# Altium schematic sheet PROC051C_DUT_Reference.SchDoc: DUT
size 431 x 279 mm; Date: Not shown in title block; ApprovedBy: Not shown in title block; CheckedBy: Not shown in title block; Author: Not shown in title block; CompanyName: Not shown in title block; Engineer: Not shown in title block; Organization: Not shown in title block; Address1: Not shown in title block; Address2: Not shown in title block; Address3: Not shown in title block; Address4: Not shown in title block; DocumentNumber: 2; Revision: Use project parameter SCH_Rev; SheetNumber: 2; SheetTotal: 16; PageSetup: Record=PageOptions|CenterHorizontal=True|CenterVertical=True|PrintScale=1.00|XCorrection=1.00|YCorrection=1.00|PrintKind=0|BorderSize=5000000|LeftOffset=0|BottomOffset=0|Orientation=2|PaperLength=1000|PaperWidth=1000|Scale=100|PaperSource=15|PrintQuality=-3|MediaType=1|DitherType=10|PrintScaleMode=1|PaperKind=Letter|PaperIndex=1; CurrentTime: Not shown in title block; CurrentDate: Not shown in title block; Time: Not shown in title block; DocumentFullPathAndName: Not shown in title block; DocumentName: Not shown in title block; ModifiedDate: Not shown in title block; ImagePath: Not shown in title block
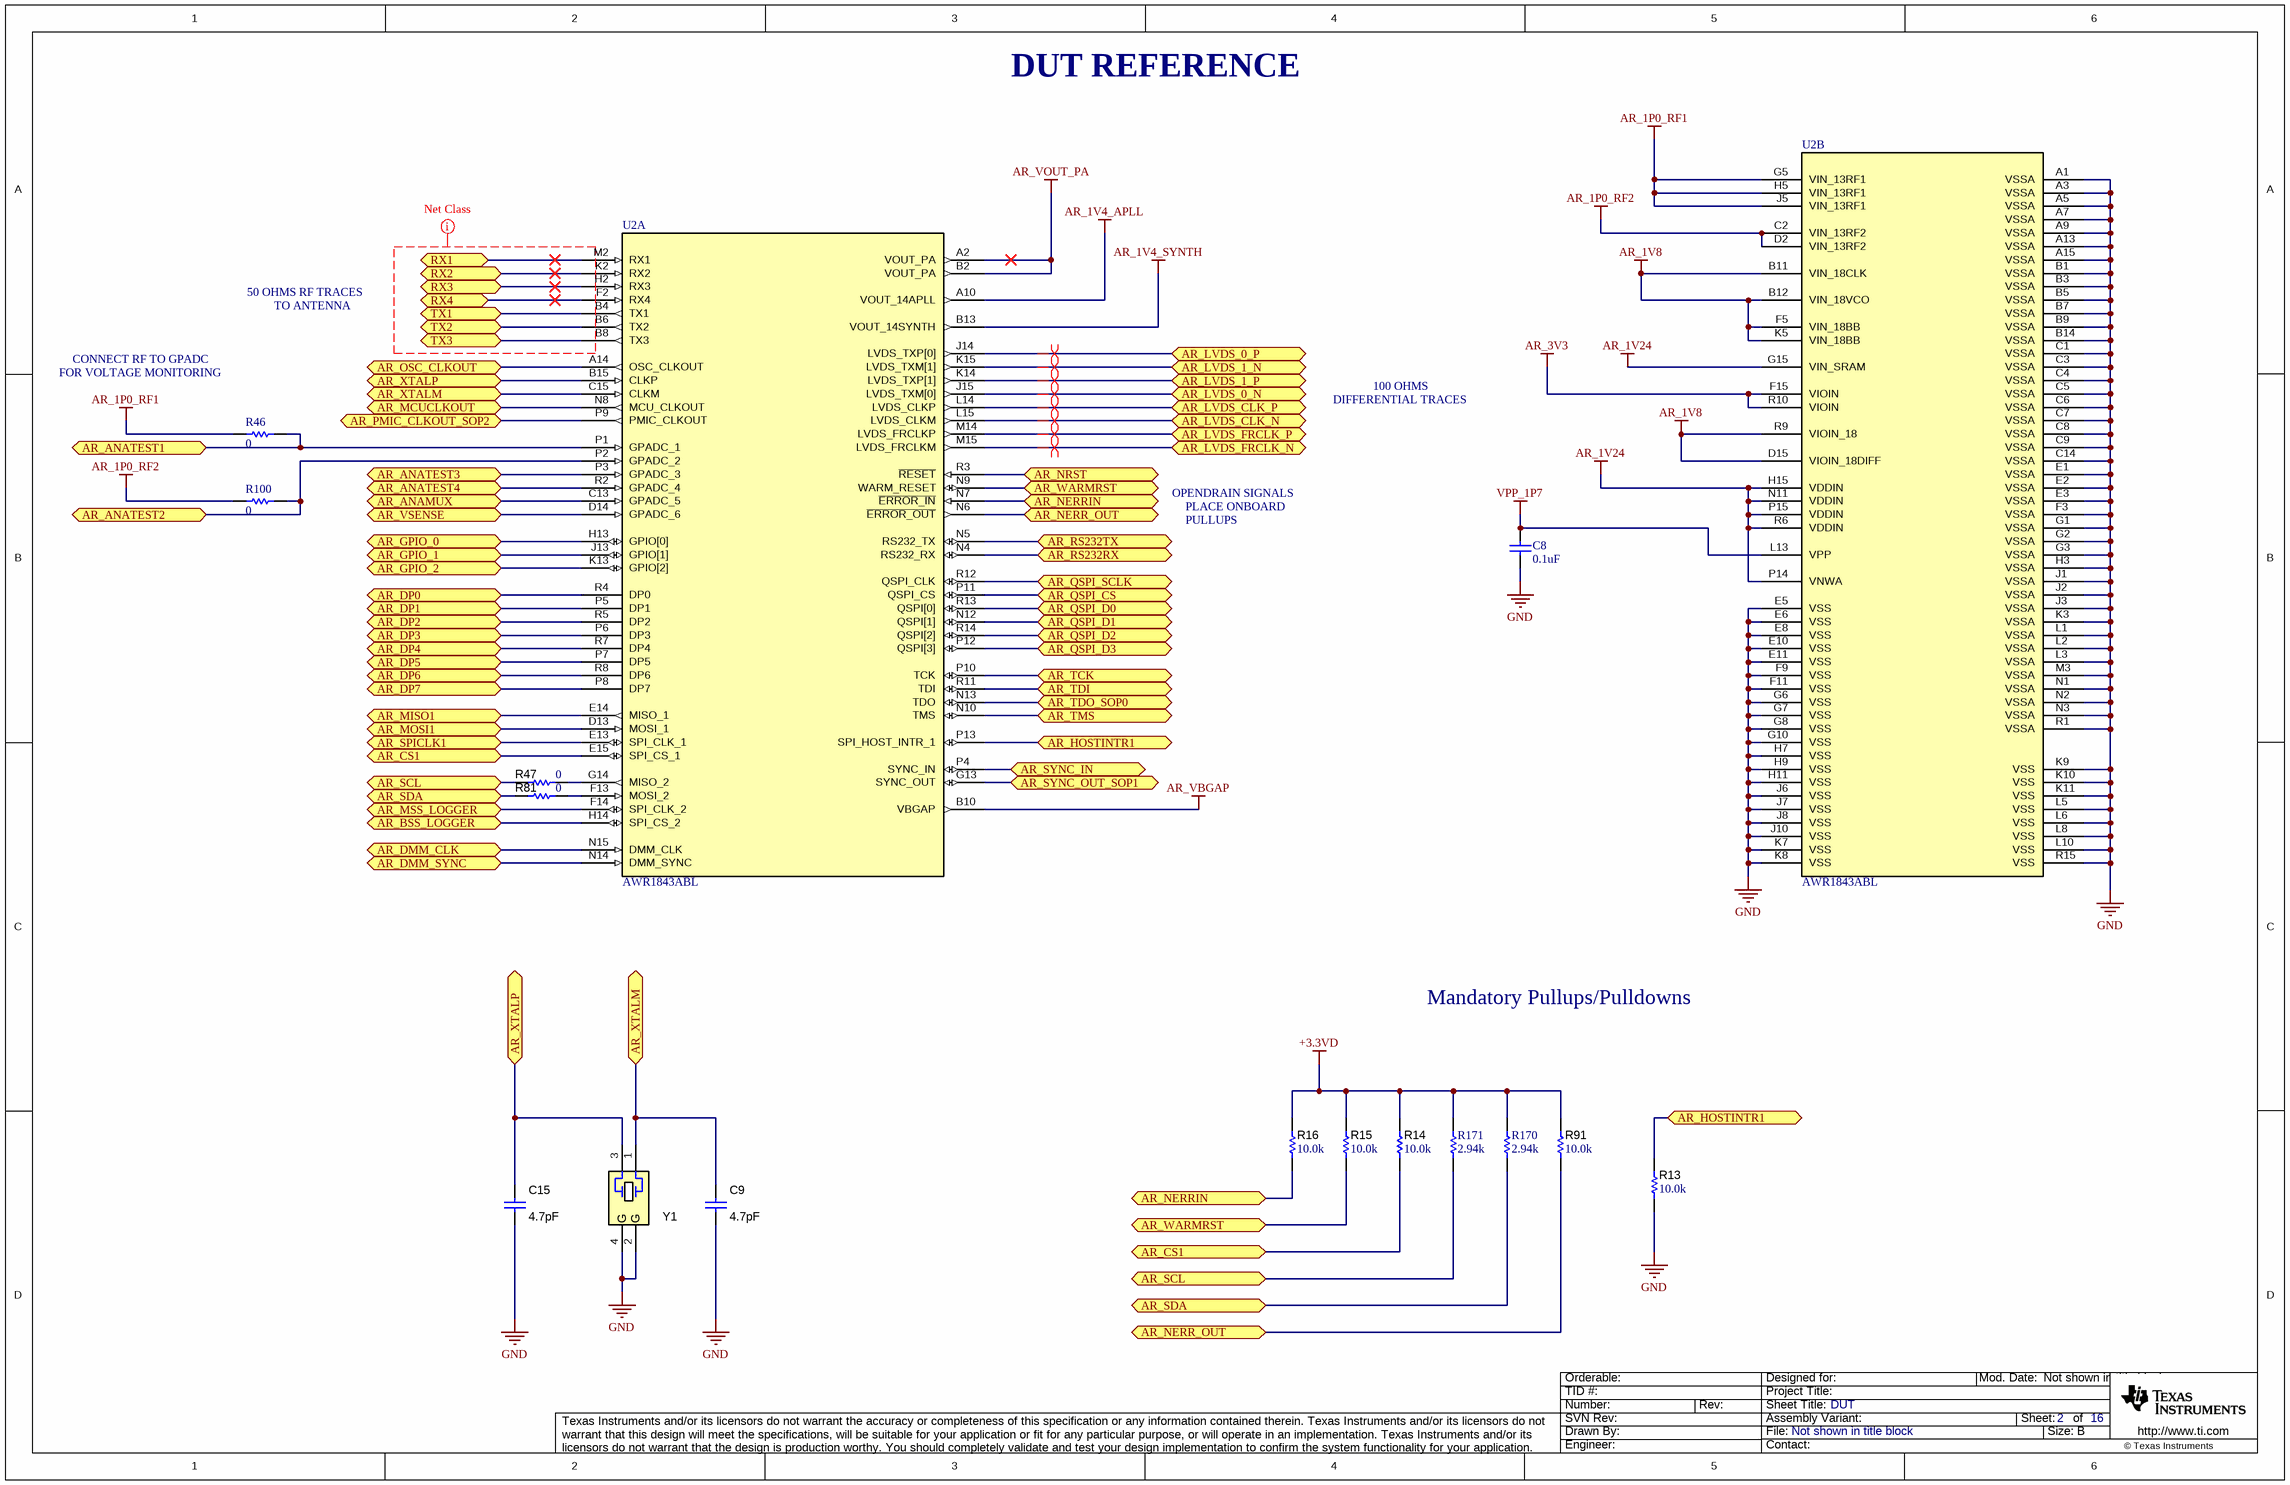
[diagram p0: PROC051C_DUT_Reference.SchDoc]

## Parts
C8  ValueDisplayed: 0.1uF  [0201]  (hidden comment: GRM033C71A104KE14D)
C9  ValueDisplayed: 4.7pF  [0402L]  (hidden comment: GJM1555C1H4R7BB01D)
C15  ValueDisplayed: 4.7pF  [0402L]  (hidden comment: GJM1555C1H4R7BB01D)
R13  ValueDisplayed: 10.0k  [0402L]  (hidden comment: CRCW040210K0FKED)
R14  ValueDisplayed: 10.0k  [0402L]  (hidden comment: CRCW040210K0FKED)
R15  ValueDisplayed: 10.0k  [0402L]  (hidden comment: CRCW040210K0FKED)
R16  ValueDisplayed: 10.0k  [0402L]  (hidden comment: CRCW040210K0FKED)
R46  ValueDisplayed: 0  [0402]  (hidden comment: CRCW04020000Z0ED)
R47  value 0  [0402L]  (hidden comment: Resistor)
R81  value 0  [0402L]  (hidden comment: Resistor)
R91  ValueDisplayed: 10.0k  [0402L]  (hidden comment: CRCW040210K0FKED)
R100  ValueDisplayed: 0  [0402]  (hidden comment: CRCW04020000Z0ED)
R170  ValueDisplayed: 2.94k  [0402]  (hidden comment: CRCW04022K94FKED)
R171  ValueDisplayed: 2.94k  [0402]  (hidden comment: CRCW04022K94FKED)
U2  AWR1843ABL  [ABL0161B]  (parts A,B of 2)
Y1  CX3225SA40000D0PTWCC  [Kyocera_CX3225SA]  (value not drawn)

## Ports
AR_ANAMUX, AR_ANATEST1, AR_ANATEST2, AR_ANATEST3, AR_ANATEST4, AR_BSS_LOGGER, AR_CS1, AR_DMM_CLK, AR_DMM_SYNC, AR_DP0, AR_DP1, AR_DP2, AR_DP3, AR_DP4, AR_DP5, AR_DP6, AR_DP7, AR_GPIO_0, AR_GPIO_1, AR_GPIO_2, AR_HOSTINTR1, AR_LVDS_0_N, AR_LVDS_0_P, AR_LVDS_1_N, AR_LVDS_1_P, AR_LVDS_CLK_N, AR_LVDS_CLK_P, AR_LVDS_FRCLK_N, AR_LVDS_FRCLK_P, AR_MCUCLKOUT, AR_MISO1, AR_MOSI1, AR_MSS_LOGGER, AR_NERR_OUT, AR_NERRIN, AR_NRST, AR_OSC_CLKOUT, AR_PMIC_CLKOUT_SOP2, AR_QSPI_CS, AR_QSPI_D0, AR_QSPI_D1, AR_QSPI_D2, AR_QSPI_D3, AR_QSPI_SCLK, AR_RS232RX, AR_RS232TX, AR_SCL, AR_SDA, AR_SPICLK1, AR_SYNC_IN, AR_SYNC_OUT_SOP1, AR_TCK, AR_TDI, AR_TDO_SOP0, AR_TMS, AR_VSENSE, AR_WARMRST, AR_XTALM, AR_XTALP, RX1, RX2, RX3, RX4, TX1, TX2, TX3

## Nets
+3.3VD: R14.2 R15.2 R16.2 R91.2 R170.2 R171.2
AR_1P0_RF1: R46.2 U2.G5(VIN_13RF1) U2.H5(VIN_13RF1) U2.J5(VIN_13RF1)
AR_1P0_RF2: R100.2 U2.C2(VIN_13RF2) U2.D2(VIN_13RF2)
AR_1V4_APLL: U2.A10(VOUT_14APLL)
AR_1V4_SYNTH: U2.B13(VOUT_14SYNTH)
AR_1V8: U2.B11(VIN_18CLK) U2.B12(VIN_18VCO) U2.D15(VIOIN_18DIFF) U2.F5(VIN_18BB) U2.K5(VIN_18BB) U2.R9(VIOIN_18)
AR_1V24: U2.G15(VIN_SRAM) U2.H15(VDDIN) U2.N11(VDDIN) U2.P14(VNWA) U2.P15(VDDIN) U2.R6(VDDIN)
AR_3V3: U2.F15(VIOIN) U2.R10(VIOIN)
AR_VBGAP: U2.B10(VBGAP)
AR_VOUT_PA: U2.A2(VOUT_PA) U2.B2(VOUT_PA)
GND: C8.2 C9.1 C15.1 R13.1 U2.A1(VSSA) U2.A3(VSSA) U2.A5(VSSA) U2.A7(VSSA) U2.A9(VSSA) U2.A13(VSSA) U2.A15(VSSA) U2.B1(VSSA) U2.B3(VSSA) U2.B5(VSSA) U2.B7(VSSA) U2.B9(VSSA) U2.B14(VSSA) U2.C1(VSSA) U2.C3(VSSA) U2.C4(VSSA) U2.C5(VSSA) U2.C6(VSSA) U2.C7(VSSA) U2.C8(VSSA) U2.C9(VSSA) U2.C14(VSSA) U2.E1(VSSA) U2.E2(VSSA) U2.E3(VSSA) U2.E5(VSS) U2.E6(VSS) U2.E8(VSS) U2.E10(VSS) U2.E11(VSS) U2.F3(VSSA) U2.F9(VSS) U2.F11(VSS) U2.G1(VSSA) U2.G2(VSSA) U2.G3(VSSA) U2.G6(VSS) U2.G7(VSS) U2.G8(VSS) U2.G10(VSS) U2.H3(VSSA) U2.H7(VSS) U2.H9(VSS) U2.H11(VSS) U2.J1(VSSA) U2.J2(VSSA) U2.J3(VSSA) U2.J6(VSS) U2.J7(VSS) U2.J8(VSS) U2.J10(VSS) U2.K3(VSSA) U2.K7(VSS) U2.K8(VSS) U2.K9(VSS) U2.K10(VSS) U2.K11(VSS) U2.L1(VSSA) U2.L2(VSSA) U2.L3(VSSA) U2.L5(VSS) U2.L6(VSS) U2.L8(VSS) U2.L10(VSS) U2.M3(VSSA) U2.N1(VSSA) U2.N2(VSSA) U2.N3(VSSA) U2.R1(VSSA) U2.R15(VSS) Y1.2(GND) Y1.4(GND)
VPP_1P7: C8.1 U2.L13(VPP)
AR_ANAMUX: U2.C13(GPADC_5) ; port AR_ANAMUX
AR_ANATEST1: R46.1 U2.P1(GPADC_1) ; port AR_ANATEST1
AR_ANATEST2: R100.1 U2.P2(GPADC_2) ; port AR_ANATEST2
AR_ANATEST3: U2.P3(GPADC_3) ; port AR_ANATEST3
AR_ANATEST4: U2.R2(GPADC_4) ; port AR_ANATEST4
AR_BSS_LOGGER: U2.H14(SPI_CS_2) ; port AR_BSS_LOGGER
AR_CS1: R14.1 U2.E15(SPI_CS_1) ; port AR_CS1
AR_DMM_CLK: U2.N15(DMM_CLK) ; port AR_DMM_CLK
AR_DMM_SYNC: U2.N14(DMM_SYNC) ; port AR_DMM_SYNC
AR_DP0: U2.R4(DP0) ; port AR_DP0
AR_DP1: U2.P5(DP1) ; port AR_DP1
AR_DP2: U2.R5(DP2) ; port AR_DP2
AR_DP3: U2.P6(DP3) ; port AR_DP3
AR_DP4: U2.R7(DP4) ; port AR_DP4
AR_DP5: U2.P7(DP5) ; port AR_DP5
AR_DP6: U2.R8(DP6) ; port AR_DP6
AR_DP7: U2.P8(DP7) ; port AR_DP7
AR_GPIO_0: U2.H13(GPIO[0]) ; port AR_GPIO_0
AR_GPIO_1: U2.J13(GPIO[1]) ; port AR_GPIO_1
AR_GPIO_2: U2.K13(GPIO[2]) ; port AR_GPIO_2
AR_HOSTINTR1: R13.2 U2.P13(SPI_HOST_INTR_1) ; port AR_HOSTINTR1
AR_LVDS_0_N: U2.J15(LVDS_TXM[0]) ; port AR_LVDS_0_N
AR_LVDS_0_P: U2.J14(LVDS_TXP[0]) ; port AR_LVDS_0_P
AR_LVDS_1_N: U2.K15(LVDS_TXM[1]) ; port AR_LVDS_1_N
AR_LVDS_1_P: U2.K14(LVDS_TXP[1]) ; port AR_LVDS_1_P
AR_LVDS_CLK_N: U2.L15(LVDS_CLKM) ; port AR_LVDS_CLK_N
AR_LVDS_CLK_P: U2.L14(LVDS_CLKP) ; port AR_LVDS_CLK_P
AR_LVDS_FRCLK_N: U2.M15(LVDS_FRCLKM) ; port AR_LVDS_FRCLK_N
AR_LVDS_FRCLK_P: U2.M14(LVDS_FRCLKP) ; port AR_LVDS_FRCLK_P
AR_MCUCLKOUT: U2.N8(MCU_CLKOUT) ; port AR_MCUCLKOUT
AR_MISO1: U2.E14(MISO_1) ; port AR_MISO1
AR_MOSI1: U2.D13(MOSI_1) ; port AR_MOSI1
AR_MSS_LOGGER: U2.F14(SPI_CLK_2) ; port AR_MSS_LOGGER
AR_NERR_OUT: R91.1 U2.N6(~{ERROR_OUT}) ; port AR_NERR_OUT
AR_NERRIN: R16.1 U2.N7(~{ERROR_IN}) ; port AR_NERRIN
AR_NRST: U2.R3(~{RESET}) ; port AR_NRST
AR_OSC_CLKOUT: U2.A14(OSC_CLKOUT) ; port AR_OSC_CLKOUT
AR_PMIC_CLKOUT_SOP2: U2.P9(PMIC_CLKOUT) ; port AR_PMIC_CLKOUT_SOP2
AR_QSPI_CS: U2.P11(QSPI_CS) ; port AR_QSPI_CS
AR_QSPI_D0: U2.R13(QSPI[0]) ; port AR_QSPI_D0
AR_QSPI_D1: U2.N12(QSPI[1]) ; port AR_QSPI_D1
AR_QSPI_D2: U2.R14(QSPI[2]) ; port AR_QSPI_D2
AR_QSPI_D3: U2.P12(QSPI[3]) ; port AR_QSPI_D3
AR_QSPI_SCLK: U2.R12(QSPI_CLK) ; port AR_QSPI_SCLK
AR_RS232RX: U2.N4(RS232_RX) ; port AR_RS232RX
AR_RS232TX: U2.N5(RS232_TX) ; port AR_RS232TX
AR_SCL: R47.2 R171.1 ; port AR_SCL
AR_SDA: R81.2 R170.1 ; port AR_SDA
AR_SPICLK1: U2.E13(SPI_CLK_1) ; port AR_SPICLK1
AR_SYNC_IN: U2.P4(SYNC_IN) ; port AR_SYNC_IN
AR_SYNC_OUT_SOP1: U2.G13(SYNC_OUT) ; port AR_SYNC_OUT_SOP1
AR_TCK: U2.P10(TCK) ; port AR_TCK
AR_TDI: U2.R11(TDI) ; port AR_TDI
AR_TDO_SOP0: U2.N13(TDO) ; port AR_TDO_SOP0
AR_TMS: U2.N10(TMS) ; port AR_TMS
AR_VSENSE: U2.D14(GPADC_6) ; port AR_VSENSE
AR_WARMRST: R15.1 U2.N9(WARM_RESET) ; port AR_WARMRST
AR_XTALM: C9.2 U2.C15(CLKM) Y1.1 ; port AR_XTALM
AR_XTALP: C15.2 U2.B15(CLKP) Y1.3 ; port AR_XTALP
RX1: U2.M2(RX1) ; port RX1
RX2: U2.K2(RX2) ; port RX2
RX3: U2.H2(RX3) ; port RX3
RX4: U2.F2(RX4) ; port RX4
TX1: U2.B4(TX1) ; port TX1
TX2: U2.B6(TX2) ; port TX2
TX3: U2.B8(TX3) ; port TX3
NetR47_1: R47.1 U2.G14(MISO_2)
NetR81_1: R81.1 U2.F13(MOSI_2)

## Layout directives
differential pair: AR_LVDS_0_N, AR_LVDS_0_P, AR_LVDS_1_N, AR_LVDS_1_P, AR_LVDS_CLK_N, AR_LVDS_CLK_P, AR_LVDS_FRCLK_N, AR_LVDS_FRCLK_P
net class RX_TX: (no net found under the mark)

## Notes on the sheet
- DUT REFERENCE
- 50 OHMS RF TRACES
- CONNECT RF TO GPADC
- TO ANTENNA
- FOR VOLTAGE MONITORING
- DIFFERENTIAL TRACES
- 100 OHMS
- OPENDRAIN SIGNALS
- PLACE ONBOARD
- PULLUPS
- Mandatory Pullups/Pulldowns
- Drawn By:
- SVN Rev:
- Number:
- TID #:
- Orderable:
- Rev:
- Sheet Title:
- File:
- Project Title:
- Designed for:
- Assembly Variant:
- Mod. Date:
- Sheet:
- Size:
- of
- B
- http://www.ti.com
- Texas Instruments and/or its licensors do not warrant the accuracy or completeness of this specification or any information contained therein. Texas Instruments and/or its licensors do not warrant that this design will meet the specifications, will be suitable for your application or fit for any particular purpose, or will operate in an implementation. Texas Instruments and/or its licensors do not warrant that the design is production worthy. You should completely validate and test your design implementation to confirm the system functionality for your application.
- Engineer:
- Contact:
- © Texas Instruments
- (in symbol CMP-0004694-3) G

## Library data of the parts
C8 = CMP-0064969-1: CAP, CERM, 0.1 uF, 10 V,+/- 10%, X7S, 0201; Manufacturer: MuRata; TaMin_C: -55°C; Polarized: N; SizeAreaWB_mm2: 2.08; Value1: Unknown; U/M: EA; Value: 0.1uF; TaMax_C: 125°C; SizeZ_mm: 0.26; SizeX_mm: 0.6; SizeY_mm: 0.3; Value2: 10V; SizeArea_mm2: 0.18; CompType: Capacitor; Cap_F: 100nF; AEC Category: Q200; ComponentLink1URL: http://search.murata.co.jp/Ceramy/image/img/A01X/G101/ENG/GRM033C71A104KE14-01.pdf; Supplier Part Number 2: 81-GRM033C71A104KE4D; Publisher: Texas Instruments; Supplier 2: Mouser; TempCo: X7S; Published: 2008-06-19; RoHS: Y; MountType: SMT; Supplier 1: Digi-Key; PackageReference: 0201; Tolerance_%: 10%; Cap_Case: 0201; LatestRevisionDate: 2017-06-05; PartNumber: GRM033C71A104KE14D; AEC Qualified: N; VDC_V: 10V; ComponentLink1Description: Datasheet link; AEC Grade: N/A; Supplier Part Number 1: 490-14450-1-ND; Technology: Ceramic
C9 C15 = CMP-0006367-2: CAP, CERM, 4.7 pF, 50 V, +/- 2%, C0G/NP0, 0402; Manufacturer: MuRata; TaMin_C: -55°C; Polarized: N; SizeAreaWB_mm2: 3; Value1: Unknown; U/M: EA; Value: 4.7pF; TaMax_C: 125°C; SizeZ_mm: 0.6; SizeX_mm: 1; SizeY_mm: 0.5; Cap_Case: 0402; Value2: 50V; CompType: Capacitor; AEC Category: Q200; Supplier Part Number 2: 81-GJM1555C1H4R7BB01; Publisher: Texas Instruments; Supplier 2: Mouser; TempCo: C0G/NP0; Published: 2008-06-19; RoHS: Y; MountType: SMT; Supplier 1: Digi-Key; PackageReference: 0402; Tolerance_%: 2%; SizeArea_mm2: 0.5; LatestRevisionDate: 2017-03-09; PartNumber: GJM1555C1H4R7BB01D; AEC Qualified: N; Cap_F: 4.7pF; VDC_V: 50V; ComponentLink1Description: Datasheet link; AEC Grade: N/A; Supplier Part Number 1: 490-8102-1-ND; Technology: Ceramic; ComponentLink1URL: http://psearch.murata.com/capacitor/product/GJM1555C1H4R7BB01%23.pdf
R13-R16 R91 = CMP-0025958-3: RES, 10.0 k, 1%, 0.063 W, AEC-Q200 Grade 0, 0402; Manufacturer: Vishay-Dale; Power_W: 63mW; TempCo: 100 ppm/C; Value_Code: 10k0; Value: 10.0k; EIA_Code: E96; Res_ohm: 10k; SizeX_mm: 1; SizeY_mm: 0.5; SizeZ_mm: 0.6; Value2: 0.063W; AEC Qualified: Y; VDC_V: 50V; AEC Category: Q200; AEC Grade: 0; Supplier Part Number 2: 52K6595; Supplier 2: Newark; Supplier Part Number 3: 71-CRCW0402-10K-E3; Supplier 3: Mouser; RoHS: E; Value1: 1%; MountType: SMT; Supplier 1: Digi-Key; PackageReference: 0402; Tolerance_%: 1%; SizeArea_mm2: 0.5; CompType: Resistor; PartNumber: CRCW040210K0FKED; ComponentLink1Description: Datasheet link; Supplier Part Number 1: 541-10.0KLCT-ND; Technology: Thick Film; ComponentLink1URL: http://www.vishay.com/docs/20035/dcrcwe3.pdf
R46 R100 = CMP-0026822-3: RES, 0, 5%, 0.063 W, AEC-Q200 Grade 0, 0402; Manufacturer: Vishay-Dale; Power_W: 63mW; TempCo: 200 ppm/C; Value_Code: 0000; Value: 0; EIA_Code: E24; SizeX_mm: 1; SizeY_mm: 0.5; SizeZ_mm: 0.6; Value2: 0.063W; CompType: Resistor; AEC Qualified: Y; VDC_V: 50V; AEC Category: Q200; Supplier Part Number 2: 52K6543; Supplier 2: Newark; Supplier Part Number 3: 71-CRCW0402-0-E3; Supplier 3: Mouser; RoHS: E; Value1: 5%; MountType: SMT; Supplier 1: Digi-Key; PackageReference: 0402; Tolerance_%: 5%; Res_ohm: 0; SizeArea_mm2: 0.5; PartNumber: CRCW04020000Z0ED; ComponentLink1Description: Datasheet link; Supplier Part Number 1: 541-0.0JCT-ND; Technology: Thick Film; ComponentLink1URL: http://www.vishay.com/docs/20035/dcrcwe3.pdf; AEC Grade: 0
R47 R81 = CMP-0026822-3: RES, 0, 5%, 0.063 W, AEC-Q200 Grade 0, 0402; PartNumber: CRCW04020000Z0ED; Manufacturer: Vishay-Dale; Value_Code: 0000; Power_W: 63mW; Value2: 0.063W; VDC_V: 50V; TempCo: 200 ppm/C; EIA_Code: E24; AEC Category: Q200; AEC Qualified: Y; SizeArea_mm2: 0.5; SizeX_mm: 1; SizeZ_mm: 0.6; CompType: Resistor; PackageReference: 0402; RoHS: E; Res_ohm: 0; Tolerance_%: 5%; Value1: 5%; MountType: SMT; Technology: Thick Film; ComponentLink1Description: Datasheet link; ComponentLink1URL: http://www.vishay.com/docs/20035/dcrcwe3.pdf; Supplier 1: Digi-Key; Supplier Part Number 1: 541-0.0JCT-ND; Supplier 2: Newark; Supplier Part Number 2: 52K6543; Supplier 3: Mouser; Supplier Part Number 3: 71-CRCW0402-0-E3; AEC Grade: 0; SizeY_mm: 0.5; ValueDisplayed: 0
R170 R171 = CMP-0026244-2: RES, 2.94 k, 1%, 0.063 W, AEC-Q200 Grade 0, 0402; Manufacturer: Vishay-Dale; Power_W: 63mW; TempCo: 100 ppm/C; Value_Code: 2k94; Value: 2.94k; EIA_Code: E96; SizeX_mm: 1; SizeY_mm: 0.5; SizeZ_mm: 0.6; Value2: 0.063W; AEC Qualified: Y; VDC_V: 50V; AEC Category: Q200; AEC Grade: 0; ComponentLink1URL: http://www.vishay.com/docs/20035/dcrcwe3.pdf; Supplier Part Number 2: 52K6814; Supplier 2: Newark; Supplier Part Number 3: 71-CRCW0402-2.94K-E3; Supplier 3: Mouser; RoHS: E; Value1: 1%; MountType: SMT; Supplier 1: Digi-Key; PackageReference: 0402; Tolerance_%: 1%; Res_ohm: 2.94k; SizeArea_mm2: 0.5; CompType: Resistor; PartNumber: CRCW04022K94FKED; ComponentLink1Description: Datasheet link; Supplier Part Number 1: 541-2.94KLCT-ND; Technology: Thick Film
U2 = CMP-0078239-1: AWR1843ABL, ABL0161B (FCBGA-161); Manufacturer: Texas Instruments; AEC Qualified: N; SizeArea_mm2: 108.16; CompType: IC; SizeAreaWB_mm2: 153.76; AEC Category: Q200; SizeY_mm: 10.4; SizeZ_mm: 1.17; PartNumber: AWR1843ABL; ComponentLink2Description: Product Folder; PackageDescription: FCBGA-161; PackageReference: ABL0161B; ComponentLink1Description: Datasheet Link; MountType: SMT; ComponentLink1URL: https://sps16.itg.ti.com/sites/KMS/crossdivteams/altium/docs/AWR1843_ballout_05Sep17.xlsx; ComponentLink2URL: TBD; Alternate Manufacturer: Texas Instruments; SizeX_mm: 10.4; PartId: 1
Y1 = CMP-0004694-3: Crystal, 40 MHz, 8pF, SMD; Manufacturer: Kyocera; TaMin_C: -40°C; Frequency Stability: +/-200ppm; SizeAreaWB_mm2: 14.7; Frequency_Fixed: 40MHz; TaMax_C: 125°C; SizeZ_mm: 0.8; SizeX_mm: 2.5; SizeY_mm: 3.2; SizeArea_mm2: 8; RoHS: Y; MountType: SMT; Supplier 1: Mouser; PackageReference: 3.2x2.5mm; CompType: Crystal; PartNumber: CX3225SA40000D0PTWCC; ComponentLink1Description: Datasheet Link; Supplier Part Number 1: 581-CX3225SA40D0PTWC; ComponentLink1URL: http://www.kyocera-crystal.jp/eng/wp-content/uploads/2016/10/cx3225sa_e.pdf